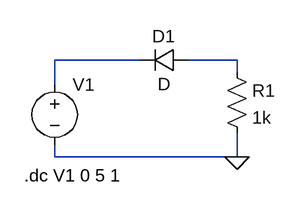
[diagram p0: schematic ReverseBias.asc]
ReverseBias.asc, the LTspice schematic file:
Version 4.1
SHEET 1 880 680
WIRE 160 48 48 48
WIRE 288 48 224 48
WIRE 288 64 288 48
WIRE 48 80 48 48
WIRE 48 176 48 160
WIRE 288 176 288 144
WIRE 288 176 48 176
FLAG 288 176 0
SYMBOL diode 224 32 R90
WINDOW 0 0 32 VBottom 2
WINDOW 3 32 32 VTop 2
SYMATTR InstName D1
SYMBOL res 272 48 R0
SYMATTR InstName R1
SYMATTR Value 1k
SYMBOL voltage 48 64 R0
WINDOW 123 0 0 Left 0
WINDOW 39 0 0 Left 0
SYMATTR InstName V1
SYMATTR Value ""
TEXT 8 200 Left 2 !.dc V1 0 5 1

The netlist it stands for:
* ReverseBias.asc
D1 N002 N001 D
R1 N002 0 1k
V1 N001 0
.model D D
.lib standard.dio
.dc V1 0 5 1
.backanno
.end